# EAGLE design MinieasySens-RFM_V03-Build007 (EAGLE 9.3.0)
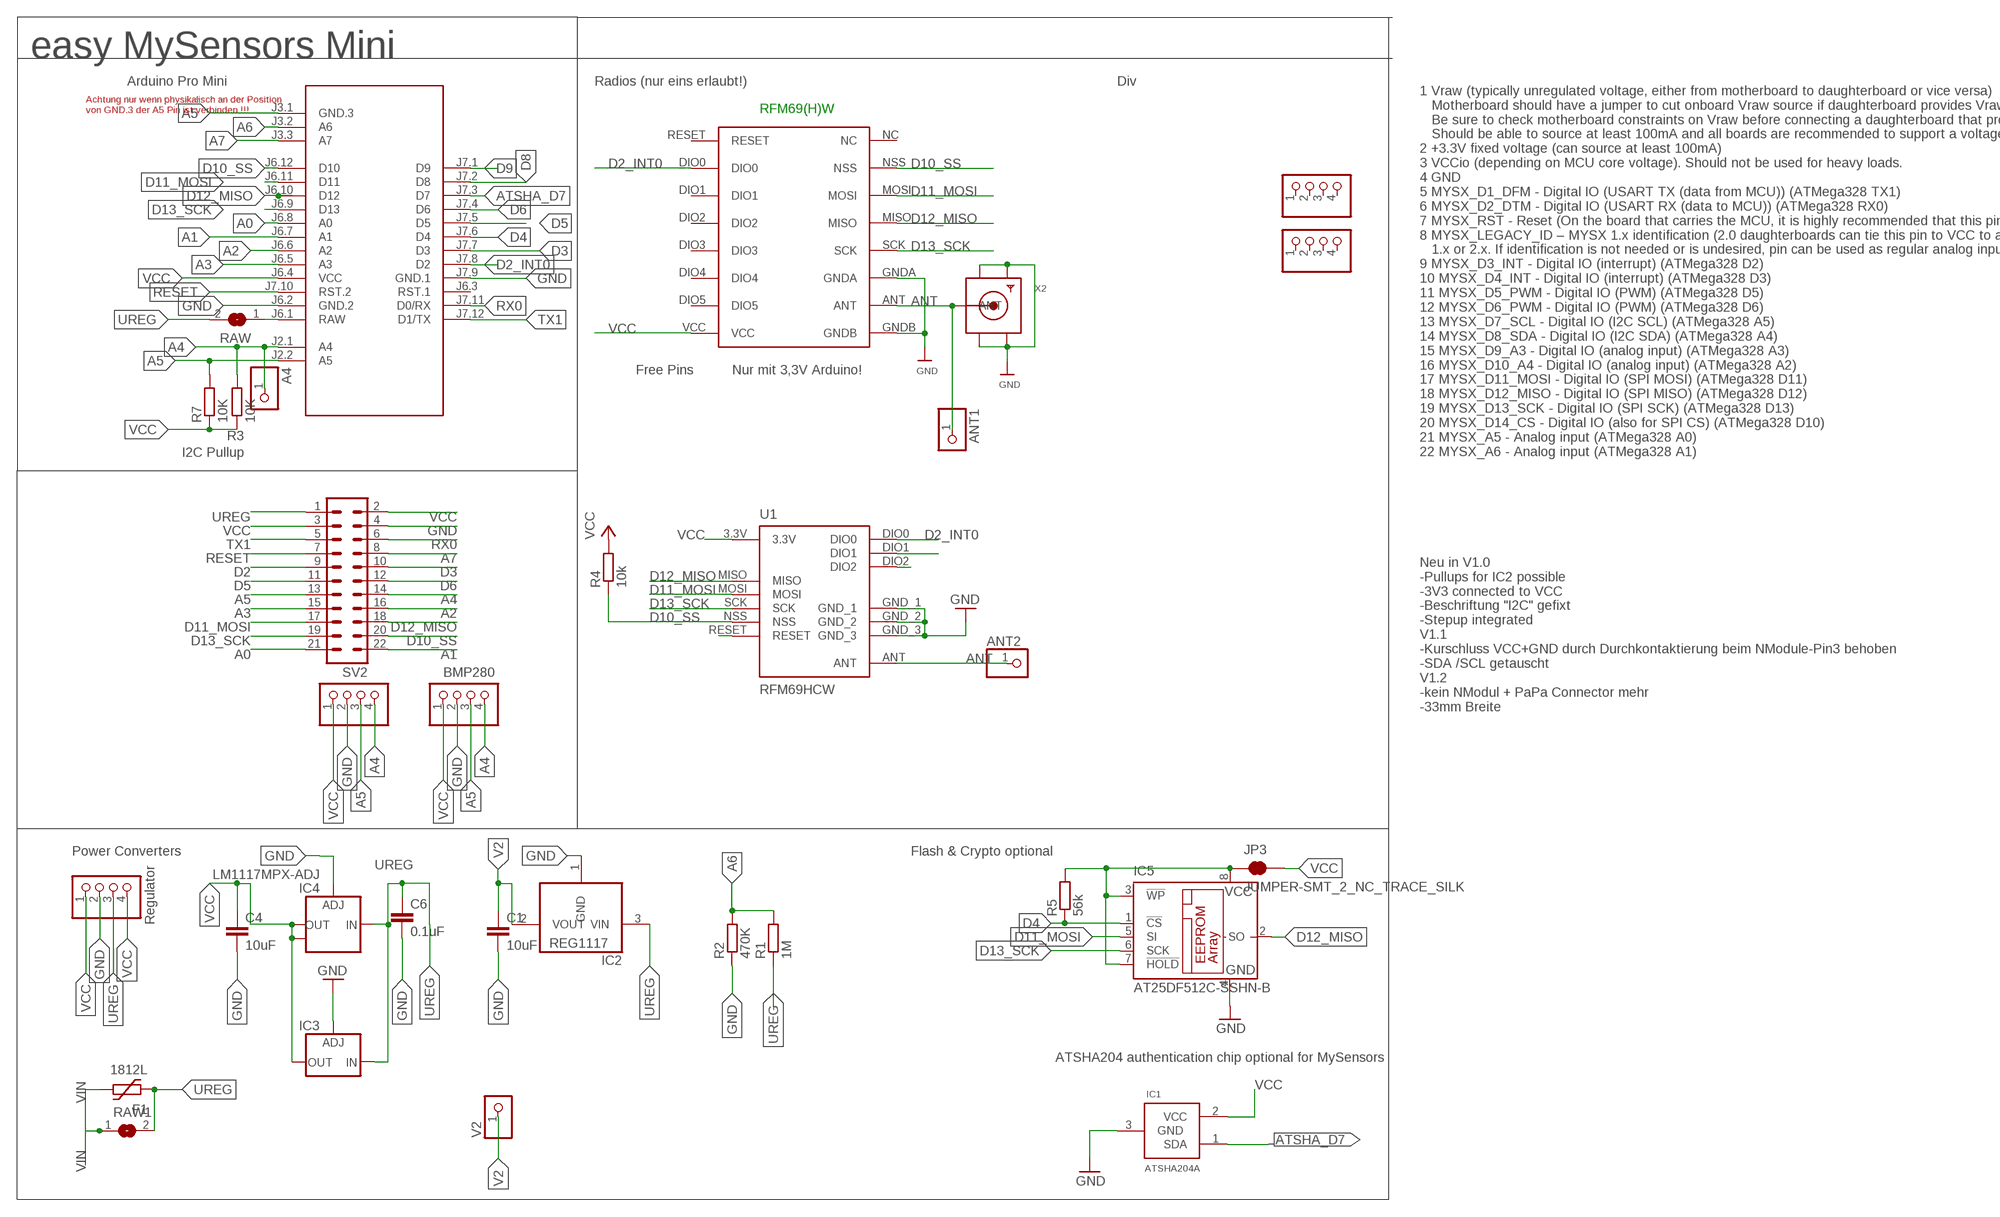
[diagram p0: schematic, sheet 1, part 1 of 2]
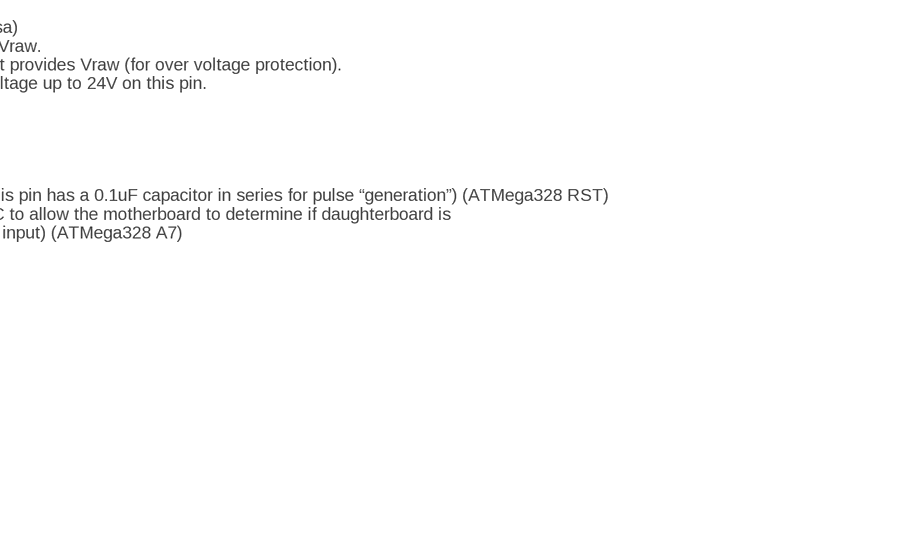
[diagram p1: schematic, sheet 1, part 2 of 2]

## Parts
A4  PINHD-1X1  [1X01]
ANT1  PINHD-1X1  [1X01]
ANT2  PINHD-1X1  [1X01]
BH1750  PINHD-1X04_2.54-S  [1X04-S]
C1  10uF  C-EUC1210  [C1210]
C4  10uF  C-EUC1210  [C1210]
C6  0.1uF  C-EUC1206  [C1206]
F1  1812L  [1812L]
I2C-1  PINHD-1X04_2.54-S  [1X04-S]
IC1  ATSHA204A  [SOT23]
IC2  REG1117  [SOT223]
IC3  LD117ADT50TR  [DPACK]
IC4  LM1117MPX-ADJ  [SOT223]
IC5  AT25DF512C-SSHN-B  25AA080SN  [SO-08]
JP1  PINHD-1X04_2.54-S  [1X04-S]
JP2  PINHD-1X04_2.54-S  [1X04-S]
JP3  JUMPER-SMT_2_NC_TRACE_SILK  [SMT-JUMPER_2_NC_TRACE_SILK]
M1  ARDUINO-PRO-MINI-3.3V#NP  [ARDUINO-PRO-MINI#NP]
R1  1M  R-EU_R0805  [R0805]
R2  470K  R-EU_R0805  [R0805]
R3  10K  R-EU_R0805  [R0805]
R4  10k  R-EU_M0805  [M0805]
R5  56k  R-EU_M0805  [M0805]
R7  10K  R-EU_R0805  [R0805]
RAW  SJ  [SJ]
RAW1  SJ  [SJ]
RFM69W  RFM69HW  [RFM]
STEPDWN  PINHD-1X04_2.54-S  [1X04-S]
SV2  MA11-2  [MA11-2]
U1  RFM69HCW  [RFM69HCW-XXXS2]
V2  PINHD-1X1  [1X01]
X2  SMACONNECTOR_EDGE  [SMA_EDGELAUNCH]

## Nets
A0: M1.J6.8(A0) SV2.21
A1: M1.J6.7(A1) SV2.22
A2: M1.J6.6(A2) SV2.16
A3: M1.J6.5(A3) SV2.15
A4: A4.1 BH1750.4 I2C-1.4 M1.J2.1(A4) R3.2 SV2.14
A5: BH1750.3 I2C-1.3 M1.J2.2(A5) M1.J3.1(GND.3) R7.2 SV2.13
A6: M1.J3.2(A6) R1.2 R2.2
A7: M1.J3.3(A7) SV2.8
ANT: ANT1.1 ANT2.1 RFM69W.ANT U1.ANT X2.P(ANT)
ATSHA_D7: IC1.1(SDA) M1.J7.3(D7)
D2: SV2.9
D2_INT0: M1.J7.8(D2) RFM69W.DIO0 U1.DIO0
D3: M1.J7.7(D3) SV2.10
D4: IC5.1(!CS) M1.J7.6(D4) R5.1
D5: M1.J7.5(D5) SV2.11
D6: M1.J7.4(D6) SV2.12
D8: M1.J7.2(D8)
D9: M1.J7.1(D9)
D10_SS: M1.J6.12(D10) R4.1 RFM69W.NSS SV2.20 U1.NSS
D11_MOSI: IC5.5(SI) M1.J6.11(D11) RFM69W.MOSI SV2.17 U1.MOSI
D12_MISO: IC5.2(SO) M1.J6.10(D12) RFM69W.MISO SV2.18 U1.MISO
D13_SCK: IC5.6(SCK) M1.J6.9(D13) RFM69W.SCK SV2.19 U1.SCK
GND [PWR]: BH1750.2 C1.2 C4.2 C6.2 I2C-1.2 IC1.3(GND) IC2.1(GND) IC3.1(ADJ) IC4.1(ADJ) IC5.4(GND) M1.J6.2(GND.2) M1.J7.9(GND.1) R2.1 RFM69W.GNDA RFM69W.GNDB STEPDWN.2 SV2.4 U1.GND_1 U1.GND_2 U1.GND_3 X2.GND@1(GND4) X2.GND@2(GND3) X2.GND@3(GND2) X2.GND@4(GND1)
N$3: U1.RESET
N$14: U1.DIO2
N$15: U1.DIO1
RAW [PWR]: M1.J6.1(RAW) RAW.1
RESET: M1.J7.10(RST.2) SV2.7
RX0: M1.J7.11(D0/RX) SV2.6
TX1: M1.J7.12(D1/TX) SV2.5
UREG [PWR]: C6.1 F1.P$1 IC2.3(VIN) IC3.3(IN) IC4.3(IN) R1.1 RAW1.2 RAW.2 STEPDWN.3 SV2.1
V2 [PWR]: C1.1 IC2.2(VOUT) V2.1
VCC [PWR]: BH1750.1 C4.1 I2C-1.1 IC1.2(VCC) IC3.4(OUT) IC4.2(OUT) IC4.TAB(OUT1) JP3.2 M1.J6.4(VCC) R3.1 R4.2 R7.1 RFM69W.VCC STEPDWN.1 STEPDWN.4 SV2.2 SV2.3 U1.3.3V
VCC1 [PWR]: IC5.3(!WP) IC5.7(!HOLD) IC5.8(VCC) JP3.1 R5.2
VIN [PWR]: F1.P$2 RAW1.1
Unconnected: JP1.1 JP1.2 JP1.3 JP1.4 JP2.1 JP2.2 JP2.3 JP2.4 M1.J6.3(RST.1) RFM69W.DIO1 RFM69W.DIO2 RFM69W.DIO3 RFM69W.DIO4 RFM69W.DIO5 RFM69W.NC RFM69W.RESET

## Notes on the sheet
- easy MySensors Mini
- Arduino Pro Mini | Radios (nur eins erlaubt!) | Div
- Achtung nur wenn physikalisch an der Position 
  von GND.3 der A5 Pin ist verbinden !!!
- RFM69(H)W
- Free Pins | Nur mit 3,3V Arduino!
- I2C Pullup
- 1 Vraw (typically unregulated voltage, either from motherboard to daughterboard or vice versa)
     Motherboard should have a jumper to cut onboard Vraw source if daughterboard provides Vraw. 
     Be sure to check motherboard constraints on Vraw before connecting a daughterboard that provides Vraw (for over voltage protection). 
     Should be able to source at least 100mA and all boards are recommended to support a voltage up to 24V on this pin.
  2 +3.3V fixed voltage (can source at least 100mA)
  3 VCCio (depending on MCU core voltage). Should not be used for heavy loads.
  4 GND
  5 MYSX_D1_DFM - Digital IO (USART TX (data from MCU)) (ATMega328 TX1)
  6 MYSX_D2_DTM - Digital IO (USART RX (data to MCU)) (ATMega328 RX0)
  7 MYSX_RST - Reset (On the board that carries the MCU, it is highly recommended that this pin has a 0.1uF capacitor in series for pulse “generation”) (ATMega328 RST)
  8 MYSX_LEGACY_ID – MYSX 1.x identification (2.0 daughterboards can tie this pin to VCC to allow the motherboard to determine if daughterboard is 
     1.x or 2.x. If identification is not needed or is undesired, pin can be used as regular analog input) (ATMega328 A7)
  9 MYSX_D3_INT - Digital IO (interrupt) (ATMega328 D2)
  10 MYSX_D4_INT - Digital IO (interrupt) (ATMega328 D3)
  11 MYSX_D5_PWM - Digital IO (PWM) (ATMega328 D5)
  12 MYSX_D6_PWM - Digital IO (PWM) (ATMega328 D6)
  13 MYSX_D7_SCL - Digital IO (I2C SCL) (ATMega328 A5)
  14 MYSX_D8_SDA - Digital IO (I2C SDA) (ATMega328 A4)
  15 MYSX_D9_A3 - Digital IO (analog input) (ATMega328 A3)
  16 MYSX_D10_A4 - Digital IO (analog input) (ATMega328 A2)
  17 MYSX_D11_MOSI - Digital IO (SPI MOSI) (ATMega328 D11)
  18 MYSX_D12_MISO - Digital IO (SPI MISO) (ATMega328 D12)
  19 MYSX_D13_SCK - Digital IO (SPI SCK) (ATMega328 D13)
  20 MYSX_D14_CS - Digital IO (also for SPI CS) (ATMega328 D10)
  21 MYSX_A5 - Analog input (ATMega328 A0)
  22 MYSX_A6 - Analog input (ATMega328 A1)
- BMP280
- Neu in V1.0
  -Pullups for IC2 possible
  -3V3 connected to VCC
  -Beschriftung "I2C" gefixt
  -Stepup integrated
  V1.1
  -Kurschluss VCC+GND durch Durchkontaktierung beim NModule-Pin3 behoben
  -SDA /SCL getauscht
  V1.2
  -kein NModul + PaPa Connector mehr
  -33mm Breite
- Power Converters | Flash & Crypto optional
- Regulator
- ATSHA204 authentication chip optional for MySensors

## Library data of the parts
A4 ANT1 ANT2 V2 = pinhead:PINHD-1X1: PIN HEADER
BH1750 I2C-1 JP1 JP2 STEPDWN = pinhead-2:PINHD-1X04: PIN HEADER
C1 C4 C6 = rcl:C-EU: CAPACITOR, European symbol
F1 = ptc-littlefuse:1812L
IC1 = Sensor:ATSHA204A
IC2 = burr-brown:REG1117: 800mA and 1A Low Dropout (LDO) Positive Regulator 1.8V, 2.5V, 2.85V, 3.3V, 5V, and Adj; MPN: REG1117; OC_FARNELL: 1097566; OC_NEWARK: 14P6981
IC3 = v-reg:LD117A?*: Low drop fixed and adjustable positive voltage regulators 1 A Source: http://www.st.com/stonline/products/literature/ds/7194/ld1117axx.pdf
IC4 = lm1117:LM1117MPX-ADJ
IC5 = microchip:25*: Serial EEPROM 4K/ 8K , SPI bus; MF: MICROCHIP; MPN: 25AA080/SN; OC_FARNELL: 1816072; OC_NEWARK: 92C7351
JP3 = SparkFun-Jumpers:JUMPER-SMT_2_NC_TRACE: Normally closed trace jumper This jumper has a trace between two pads so it's normally closed (NC). Use a razor knife to open the connection. For best results follow the IPC guidelines for cutting traces: Cutout at least 0.063 mm (0.005 in). Remove all loose material to clean up the cut area. Seal the cut with an approved epoxy. Reapply solder to reclose the connection.
M1 = diy-modules:ARDUINO-PRO-MINI-*#NP: Arduino Pro Mini without programming pads
R1-R4 R7 = rcl:R-EU_: RESISTOR, European symbol
R5 = resistor:R-EU_: RESISTOR, European symbol
RAW RAW1 = jumper:SJ: SMD solder JUMPER
RFM69W = hoperf:RFM69HW
SV2 = con-Pinheader:MA11-2: PIN HEADER; OC_FARNELL: unknown; OC_NEWARK: unknown
U1 = doug:RFM69H
X2 = adafruit:SMACONNECTOR: SMA Connector 90° DIP SMA Connector, 50 Ohm (4UConnector: 07259)

## Net classes
0 default: width 0.254 mm, clearance 0.205 mm
1 PWR: width 0.406 mm, clearance 0.205 mm to class 0, clearance 0.205 mm

## Board
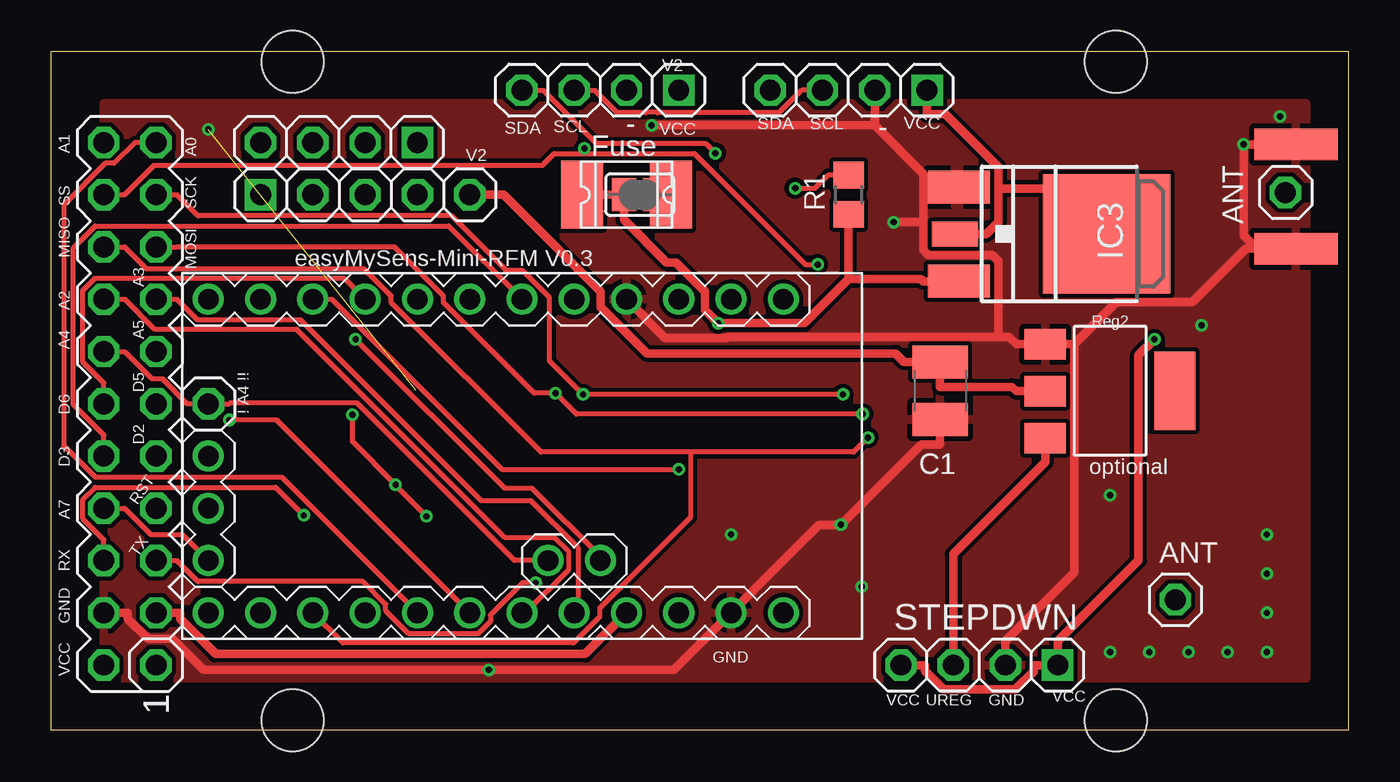
[diagram p2: board, top side]
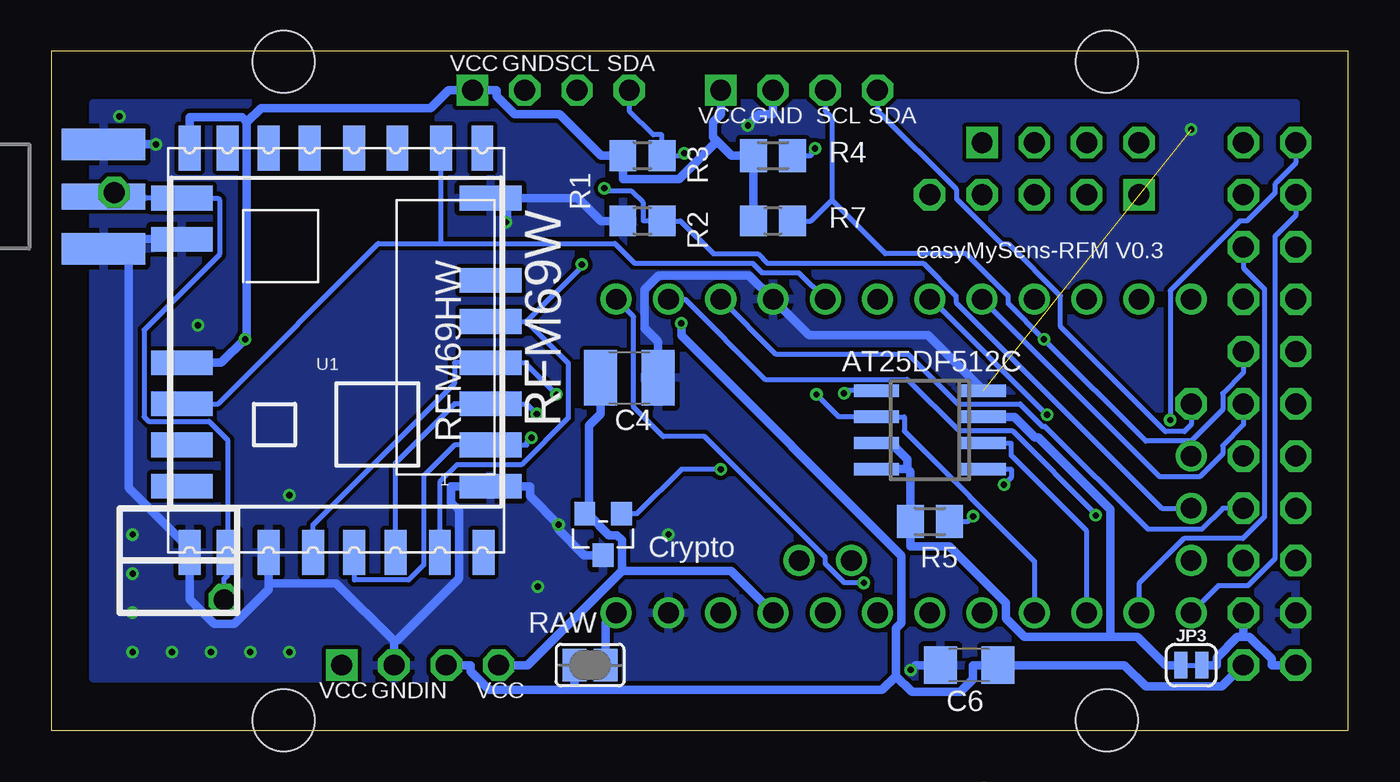
[diagram p3: board, bottom side, seen from below]

Size 63 x 33 mm. Coordinates in mm from the lower left corner, seen from the top.
Outline: 63,0 0,0 0,33 63,33 63,0
Copper layers (1*16): Top 0.035mm / dielectric 1.5mm / Bottom 0.035mm
Design rules "dirt_cheap_dirty_boards.v1": minimum track width 5mil, minimum drill 12mil, track to track 5mil, track to pad 5mil, pad to pad 5mil, via to via 5mil, smd to smd 0mil, copper to edge 10mil, drill to drill 10mil, minimum pad ring 10mil, minimum via ring 6mil, stop-mask expansion 2mil, vias tented up to drill 25mil, thermal gap 10mil
Holes 3 mm at 11.72,32.5 11.72,0.5 51.72,32.5 51.72,0.5
tRestrict: area 3.8,32.4 to 62.9,33; area 4.4,0 to 62.9,1.3
bRestrict: area 3.8,32.4 to 62.9,33; area 4.4,0 to 62.9,1.3

### Footprints (pad centres in the part's own frame; a part is rotated, then mirrored left to right if it is on the bottom)
1X01 = drill 1.016 octagon: 1 0,0
1X04-S = drill 1.016 square: 1 -3.81,0 | drill 1.016 octagon: 2 -1.27,0; 3 1.27,0; 4 3.81,0
C1210 = smd 1.6 x 2.7: 1 -1.4,0; 2 1.4,0
C1206 = smd 1.6 x 1.8: 1 -1.4,0; 2 1.4,0
1812L = smd 2.03 x 3.3: P$1 -2.16,0; P$2 2.16,0
SOT23 = smd 1.016 x 1.143: 1 -0.889,-1.016; 2 0.889,-1.016; 3 0,1.016
SOT223 = smd 1.499 x 2.007: 1 -2.261,-3.15; 2 0.025,-3.15; 3 2.311,-3.15 | smd 3.81 x 2.007: 4 0,3.15
DPACK = smd 1.6 x 3: 1 -2.28,-4.8; 3 2.28,-4.8 | smd 5.8 x 6.2: 4 0,2.38
SOT223' = smd 1.219 x 2.235: 1 -2.311,-3.099; 2 0,-3.099; 3 2.311,-3.099 | smd 3.6 x 2.2: TAB 0,3.099
SO-08 = smd 0.6 x 2.2: 1 -1.905,-2.6; 2 -0.635,-2.6; 3 0.635,-2.6; 4 1.905,-2.6; 5 1.905,2.6; 6 0.635,2.6; 7 -0.635,2.6; 8 -1.905,2.6
SMT-JUMPER_2_NC_TRACE_SILK = smd 0.635 x 1.27: 1 -0.508,0; 2 0.508,0
ARDUINO-PRO-MINI#NP = drill 1: J2.1 -1.27,5.08; J2.2 -3.81,5.08; J3.1 15.24,0; J3.2 15.24,2.54; J3.3 15.24,5.08; J6.1 -12.7,7.62; J6.2 -10.16,7.62; J6.3 -7.62,7.62; J6.4 -5.08,7.62; J6.5 -2.54,7.62; J6.6 0,7.62; J6.7 2.54,7.62; J6.8 5.08,7.62; J6.9 7.62,7.62; J6.10 10.16,7.62; J6.11 12.7,7.62; J6.12 15.24,7.62; J7.1 15.24,-7.62; J7.2 12.7,-7.62; J7.3 10.16,-7.62; J7.4 7.62,-7.62; J7.5 5.08,-7.62; J7.6 2.54,-7.62; J7.7 0,-7.62; J7.8 -2.54,-7.62; J7.9 -5.08,-7.62; J7.10 -7.62,-7.62; J7.11 -10.16,-7.62; J7.12 -12.7,-7.62
R0805 = smd 1.3 x 1.5: 1 -0.95,0; 2 0.95,0
M0805 = smd 1.3 x 1.6: 1 -0.95,0; 2 0.95,0
SJ = smd 1.168 x 1.6: 1 -0.762,0; 2 0.762,0
RFM = smd 2.184 x 1.067: ANT 19.651,2.889; DIO0 0,13.27; DIO1 0,11.143; DIO2 0,9.047; DIO3 0,6.889; DIO4 0,4.889; DIO5 0,2.889; GNDA 19.651,4.889; GNDB 19.651,1.048; MISO 19.651,9.047; MOSI 19.651,11.047; NC 19.651,15.334; NSS 19.651,13.206; RESET 0,15.27; SCK 19.651,7.048; VCC 0,1.048
MA11-2 = drill 1.016 octagon: 1 -12.7,-1.27; 2 -12.7,1.27; 3 -10.16,-1.27; 4 -10.16,1.27; 5 -7.62,-1.27; 6 -7.62,1.27; 7 -5.08,-1.27; 8 -5.08,1.27; 9 -2.54,-1.27; 10 -2.54,1.27; 11 0,-1.27; 12 0,1.27; 13 2.54,-1.27; 14 2.54,1.27; 15 5.08,-1.27; 16 5.08,1.27; 17 7.62,-1.27; 18 7.62,1.27; 19 10.16,-1.27; 20 10.16,1.27; 21 12.7,-1.27; 22 12.7,1.27
RFM69HCW-XXXS2 = smd 3 x 1.2: 3.3V 7.5,1; ANT 7.5,-7; DIO0 7.5,3; DIO1 7.5,5; DIO2 7.5,7; GND_1 7.5,-5; GND_2 -7.5,-7; GND_3 -7.5,7; MISO -7.5,5; MOSI -7.5,3; NSS -7.5,-1; RESET -7.5,-3; SCK -7.5,1
SMA_EDGELAUNCH = smd 4.064 x 1.524: GND@1 2.032,-2.54; GND@2 2.032,2.54 | smd 4.064 x 1.524 bottom: GND@3 2.032,2.54; GND@4 2.032,-2.54 | smd 4.064 x 1.27: P 2.032,0

### Placement (x,y rotation side)
A4  7.62,15.88 90 top
ANT1  59.96,26.14 0 top
ANT2  54.61,6.35 0 top
BH1750  38.73,31.11 180 top
C1  43.18,16.51 270 top
C4  34.92,17.14 0 bottom
C6  18.41,3.17 180 bottom
F1  27.94,26.04 0 top
I2C-1  26.67,31.11 180 top
IC1  36.2,9.53 180 bottom
IC2  51.44,16.51 270 top
IC3  48.9,24.13 270 top
IC4  LM1117MPX-ADJ  [SOT223']  46.99,24.13 270 top
IC5  20.32,14.61 90 bottom
JP1  13.97,26.04 0 top
JP2  13.97,28.57 180 top
JP3  7.62,3.17 0 bottom
M1  22.86,13.34 180 top
R1  38.73,26.04 90 top
R2  34.29,24.77 0 bottom
R3  34.29,27.94 0 bottom
R4  27.94,27.94 180 bottom
R5  20.32,10.16 180 bottom
R7  27.94,24.77 0 bottom
RAW  36.83,3.17 180 bottom
RAW1  28.57,26.04 180 top
RFM69W  57.34,28.3 270 bottom
STEPDWN  45.09,3.17 180 top
SV2  3.81,15.88 90 top
U1  49.16,18.87 180 bottom
V2  20.32,26.04 0 top
X2  62.5,25.95 0 bottom

### Tracks (layer width: path | path; a pad name or v marks a point on that pad's centre or on a via)
A0
  Top 0.254: SV2.21 4.06,28.57 3.05,27.56 2.62,27.56 0.6,25.54 0.6,13.84 2.12,12.32 11.18,12.32 M1.J6.8
A1  (via drill 0.3 pad 0.61)
  Top 0.254: M1.J6.7 10.95,15.09 v8.64,15.09
  Bottom 0.254: v8.64,15.09 8.64,21.38 5.25,24.77 4.91,24.77 3.56,26.12 3.56,26.54 2.54,27.56 SV2.22
A2
  Top 0.254: M1.J6.6 23.02,5.71 25.14,7.84 25.14,8.67 24.45,9.36 22.05,9.36 11.92,19.49 5.02,19.49 3.56,20.95 SV2.16
A3
  Top 0.254: M1.J6.5 25.6,5.92 25.6,8.87 23.31,11.16 20.89,11.16 12.11,19.95 7.1,19.95 6.1,20.95 SV2.15
A4  (via drill 0.3 pad 0.61)
  Top 0.254: M1.J2.1 22.5,8.26 14.86,15.9 8.66,15.9 8.64,15.88 A4.1 6.6,15.88 5.38,17.1 4.87,17.1 3.56,18.41 SV2.14 | v32.26,28.05 31.8,28.51 26.48,28.51 23.88,31.11 I2C-1.4
  Bottom 0.254: I2C-1.4 22.86,30.1 22.83,30.1 19.01,26.27 19.01,25.82 16.81,23.63 16.48,23.63 13.97,21.11 13.97,19.63 8.87,14.53 7.95,14.53 7.62,14.86 A4.1 | v32.26,28.05 32.32,28.05 32.44,27.94 R3.2 33.34,28.94 33.77,28.94 34.92,30.1 BH1750.4
A5  (via drill 0.3 pad 0.61)
  Top 0.254: v14.78,19.01 22.01,11.78 23.34,11.78 26.67,8.45 M1.J2.2 | BH1750.3 36.45,31.11 35.35,30.02 29.45,30.02 29.42,30.05 28.89,30.05 28.87,30.02 27.49,30.02 26.42,31.09 26.42,31.11 I2C-1.3
  Bottom 0.254: 7.62,14.07 M1.J3.1 | 7.62,14.07 6.1,15.59 6.1,16.38 5.08,17.4 SV2.13 | 7.62,14.07 9.84,14.07 v14.78,19.01 16.51,20.74 16.51,21.12 18.56,23.17 22.48,23.17 25.08,25.77 | 25.08,25.77 26.09,24.77 R7.2 | 25.08,25.77 25.08,29.78 25.4,30.1 I2C-1.3
A6  (via drill 0.3 pad 0.61)
  Top 0.254: R1.2 37.73,26.98 37.1,26.35 v36.13,26.35
  Bottom 0.254: M1.J3.2 9.05,10.79 19.05,20.8 19.05,21.11 20.64,22.71 28.22,22.71 28.68,23.17 30.84,23.17 32.44,24.77 R2.2 33.79,24.77 34.24,24.77 34.24,25.64 34.81,26.2 35.98,26.2 v36.13,26.35
A7
  Top 0.254: SV2.8 3.56,10.79 4.83,9.53 6.35,9.53 M1.J3.3
ANT
  Bottom 0.254: ANT2.1 54.61,7.37 54.45,7.53 RFM69W.ANT 54.45,14.12 55.34,15.02 58.27,15.02 58.5,15.24 58.5,19.47 54.83,23.13 54.83,25.79 54.91,25.87 U1.ANT 58.42,25.87 58.6,26.05 59.96,26.05 | X2.P 60.06,25.95 59.96,26.05 | 59.96,26.05 ANT1.1
ATSHA_D7  (via drill 0.3 pad 0.61)
  Top 0.254: M1.J7.3 13.62,20.95 21.89,12.69 v30.48,12.69
  Bottom 0.254: IC1.1 34.54,10.54 32.4,12.69 v30.48,12.69
D2_INT0
  Bottom 0.254: 44.06,23.66 35.62,23.66 34.66,22.71 28.94,22.71 28.48,22.25 26.69,22.25 M1.J7.8 | 44.06,23.66 RFM69W.DIO0 | 44.06,23.66 47.12,23.66 54.91,15.87 U1.DIO0
D3
  Top 0.254: M1.J7.7 19.3,24.51 2.12,24.51 1.06,23.45 1.06,15.83 2.54,14.35 SV2.10
D4  (via drill 0.3 pad 0.61)
  Top 0.254: v14.62,15.34 14.62,14.04 v16.72,11.94 16.72,11.9 v18.22,10.41
  Bottom 0.254: v14.62,15.34 20.24,20.95 M1.J7.6 | v18.22,10.41 18.47,10.16 R5.1 | v16.72,11.94 16.37,12.29 16.37,12.7 IC5.1
D5
  Bottom 0.254: M1.J7.5 9.15,12.32 7.2,12.32 6.1,13.43 6.1,13.84 5.08,14.86 SV2.11
D6
  Top 0.254: M1.J7.4 14.22,21.98 2.12,21.98 1.52,21.38 1.52,17.91 2.54,16.89 SV2.12
D10_SS  (via drill 0.3 pad 0.61)
  Top 0.254: 25.9,28.04 31.24,28.04 36.64,22.64 v37.23,22.64 | 25.9,28.04 v25.9,28.29 | 25.9,28.04 24.43,28.04 23.86,27.47 4.99,27.47 3.56,26.04 SV2.20
  Bottom 0.254: SV2.20 2.54,25.02 3.56,24 3.56,8.34 4.87,7.03 6.31,7.03 M1.J6.12 | v37.23,22.64 37.23,22.55 39.91,19.87 | 39.91,19.87 37.9,17.86 37.9,15.17 40.16,12.91 43.3,12.91 44.13,12.07 RFM69W.NSS | U1.NSS 39.91,19.87 | v25.9,28.29 26.09,28.1 26.09,27.94 R4.1
D11_MOSI  (via drill 0.3 pad 0.61)
  Top 0.254: v39.42,15.38 25.5,15.38 v24.49,16.39 23.45,16.39 19.05,20.79 19.05,21.11 16.67,23.5 6.1,23.5 SV2.17
  Bottom 0.254: v24.49,16.39 24.37,16.51 24.27,16.51 IC5.5 | SV2.17 5.08,22.48 4.06,21.46 4.06,10.38 5.11,9.33 7.98,9.33 10.16,7.14 M1.J6.11 | v39.42,15.38 39.91,15.87 U1.MOSI 43.42,15.87 46.29,13 RFM69W.MOSI
D12_MISO  (via drill 0.3 pad 0.61)
  Top 0.254: 31.04,13.53 23.78,13.53 16.51,20.8 16.51,21.12 15.19,22.43 4.62,22.43 3.56,23.5 SV2.18 | v39.68,14.23 38.98,13.53 31.04,13.53 | 31.04,13.53 31.04,10.36 26.63,5.94 26.63,5.52 25.36,4.25 14.17,4.25 M1.J6.10
  Bottom 0.254: IC5.2 16.37,13.97 16.37,13.35 12.7,9.69 M1.J6.10 | v39.68,14.23 39.91,13.99 39.91,13.87 U1.MISO 42.16,13.87 43.42,13.87 44.92,12.37 44.92,8.04 45.65,7.31 48.29,7.31 RFM69W.MISO
D13_SCK  (via drill 0.3 pad 0.61)
  Top 0.254: v38.46,16.33 v25.83,16.33 24.2,17.96 24.2,21.05 22.9,22.34 22.12,22.34 19.45,25.02 7.11,25.02 6.1,26.04 SV2.19
  Bottom 0.254: M1.J6.9 15.24,8.22 21.57,14.54 21.57,15.24 IC5.6 23.54,15.24 24.27,15.24 24.74,15.24 v25.83,16.33 | RFM69W.SCK 50.29,10 43.42,16.87 43.42,17.87 U1.SCK 40.79,17.87 39.91,17.87 39.91,17.78 v38.46,16.33
GND  (via drill 0.3 pad 0.61)  (1 unrouted)
  Top 0.406: 42.37,24.7 42.37,26.44 | 46.01,19.12 46.01,22.82 45.71,23.11 42.59,23.11 42.37,23.34 42.37,24.7 | 42.37,24.7 v40.92,24.7 | 40,29.41 40.01,29.41 40.01,29.95 BH1750.2 | v29.16,29.41 40,29.41 | 42.37,26.44 42.37,27.04 40,29.41 | 46.01,19.12 32.87,19.12 32.83,19.08 29.82,19.08 M1.J7.9 | 46.01,19.12 46.53,19.12 46.87,18.77 IC2.1 49.7,18.77 | 42.37,26.44 IC4.1 44.06,26.44 IC3.1 | 58.56,23.41 57.92,24.05 v57.92,28.48 58.42,28.48 58.43,28.49 X2.GND@2 | 58.56,23.41 58.03,23.41 55.44,20.82 51.75,20.82 49.7,18.77 | X2.GND@1 58.56,23.41 | SV2.4 3.71,5.71 3.71,5.43 4.69,4.45 5.9,4.45 7.4,2.94 v21.25,2.94 30.25,2.94 M1.J6.2 37.3,10 v38.36,10 42.27,13.9 43.18,13.9 C1.2 | STEPDWN.2 46.35,4.34 49.7,7.69 49.7,18.77
  Bottom 0.406: 40.86,25.87 40.86,24.76 v40.92,24.7 | 40.86,25.87 39.76,25.87 37.4,25.87 36.3,24.77 35.77,24.77 35.74,24.77 R2.1 | U1.GND_2 40.86,25.87 | 59.25,23.41 59.03,23.41 58.57,23.87 U1.GND_1 | 59.25,23.41 59.25,11.78 56.66,9.19 56.29,9.19 RFM69W.GNDB 56.29,6.37 55.09,5.18 54.13,5.18 52.45,6.86 52.45,7.15 | 46.35,4.34 49.16,7.15 52.45,7.15 | X2.GND@1 59.25,23.41 | v57.92,28.48 57.94,28.49 58.03,28.49 X2.GND@2 | I2C-1.2 27.94,29.95 28.62,29.95 v29.16,29.41 | IC5.4 20.43,19.21 26.2,19.21 M1.J7.9 29.1,22.12 33.5,22.12 34.18,21.44 34.18,19.56 33.52,18.9 C4.2 | v21.25,2.94 21.02,3.17 C6.2 | 46.35,4.34 46.23,4.34 43.19,7.39 43.19,10.71 43.57,11.09 43.57,11.87 U1.GND_3 39.76,11.87 39.76,11.39 v38.36,10 38.36,9.76 37.11,8.51 IC1.3 | 46.35,4.34 46.35,4.19 STEPDWN.2 | RFM69W.GNDA 52.45,7.15
  other vias: 7.62,29.21 51.44,3.81 53.34,3.81 55.24,3.81 57.15,3.81 59.05,3.81 59.05,5.71 59.05,7.62 59.05,9.53 59.69,29.84 55.88,19.68 51.44,11.43 39.37,6.99 33.02,9.53
  pour Top: 2.54,30.48 2.54,2.54 60.96,2.54 60.96,30.48
  pour Bottom: 2.54,30.48 60.96,30.48 60.96,2.54 2.54,2.54
RAW
  Bottom 0.406: RAW.1 36.07,5.21 M1.J6.1
RESET
  Bottom 0.254: M1.J7.10 27.83,18.3 21.39,18.3 18.96,15.87 15.94,15.87 14.86,14.78 14.72,14.78 9.72,9.79 7.1,9.79 6.1,10.79 SV2.7
RX0  (via drill 0.3 pad 0.61)
  Top 0.254: SV2.6 2.54,9.27 1.52,10.29 1.52,11.21 2.13,11.82 10.89,11.82 v12.26,10.45
  Bottom 0.254: M1.J7.11 32.21,20.95 28.32,17.07 21.42,17.07 18.92,14.57 16.31,14.57 12.26,10.51 v12.26,10.45
TX1  (via drill 0.3 pad 0.61)
  Top 0.254: v23.53,7.17 22.89,7.17 21.33,5.61 21.33,5.29 20.74,4.71 17.36,4.71 16.25,5.82 16.25,6.13 15.14,7.24 7.11,7.24 6.1,8.26 SV2.5
  Bottom 0.254: v23.53,7.17 24.48,7.17 25.4,8.1 25.4,8.42 31.26,14.28 33.28,14.28 34.72,15.71 34.72,20.11 M1.J7.12
UREG  (via drill 0.3 pad 0.61)
  Top 0.406: 38.73,21.93 42.25,21.93 42.37,21.82 IC4.3 44.06,21.82 IC3.3 | 38.73,21.93 36.59,19.79 v32.39,19.79 31.75,20.44 31.75,21.34 30.34,22.75 29.89,22.75 27.81,24.83 RAW1.2 27.2,26.04 F1.P$1 | 38.73,21.93 R1.1 | IC2.3 48.28,13.04 43.81,8.57 43.81,4.34 STEPDWN.3
  Bottom 0.406: STEPDWN.3 42.65,3.17 42.65,2.88 41.73,1.97 37.59,1.97 | 21.97,2.64 21.97,4.96 21.69,5.24 21.69,8.49 32.39,19.19 v32.39,19.79 | 21.97,2.64 21.19,1.87 18.84,1.87 18.22,2.49 18.22,3.17 C6.1 10.87,3.17 9.82,2.13 6.12,2.13 SV2.1 | 21.97,2.64 22.64,1.97 37.59,1.97 | RAW.2 37.59,1.97
V2
  Top 0.406: V2.1 21.97,26.04 26.67,21.33 26.67,20.58 28.93,18.32 41.01,18.32 41.42,17.91 C1.1 43.18,16.7 46.66,16.7 46.87,16.48 IC2.2
VCC  (via drill 0.3 pad 0.61)
  Top 0.406: v53.59,19.01 52.82,18.24 52.82,8.27 48.9,4.34 STEPDWN.1 47.73,3.17 47.73,2.88 46.85,2 43.33,2 42.45,2.89 42.45,3.17 STEPDWN.4 | 46,26.34 46,24.72 45.42,24.13 IC4.2 | 46,26.34 46,27.38 43.44,29.95 42.55,29.95 BH1750.1 | 46,26.34 50.09,26.34 IC4.TAB IC3.4 | SV2.3 6.25,5.71 6.25,5.43 7.97,3.71 25.94,3.71 M1.J6.4
  Bottom 0.406: 53.5,29.57 52.82,30.25 44.58,30.25 43.72,31.11 BH1750.1 41.38,31.11 41.38,30.82 40.5,29.95 38.3,29.95 36.3,27.94 R3.1 35.24,26.78 32.52,26.78 30.65,28.64 | 53.5,29.57 53.74,29.8 56.29,29.8 RFM69W.VCC | 53.5,29.57 53.5,19.09 v53.59,19.01 53.62,19.01 54.76,17.87 U1.3.3V | 35.28,7.76 35.28,9.25 35.52,9.49 35.91,9.49 36.89,10.47 36.89,10.54 | STEPDWN.4 39.87,3.17 35.28,7.76 | M1.J6.4 29.99,7.76 35.28,7.76 | 36.89,10.54 IC1.2 | 36.89,10.54 36.89,14.82 36.33,15.39 C4.1 | 30.65,28.64 30.85,28.84 30.85,29.57 30.48,29.95 I2C-1.1 | 30.65,28.64 29.95,27.94 29.42,27.94 R4.2 R7.1 | SV2.2 3.71,3.17 3.71,3.47 4.79,4.54 5.08,4.54 | JP3.2 6.39,3.17 6.39,3.53 5.37,4.54 5.08,4.54 | SV2.3 5.08,4.54
VCC1
  Bottom 0.406: 11.54,4.55 10.23,4.55 8.85,3.17 JP3.1 | 11.54,4.55 15.73,4.55 16.62,5.44 16.62,6.2 19.37,8.95 21.27,8.95 R5.2 21.27,10.76 21.27,11.37 21.27,12.56 21.41,12.7 | 11.54,4.55 11.54,10.75 15.04,14.25 15.22,14.25 16.21,15.24 IC5.3 | IC5.8 21.41,12.7 | 21.41,12.7 21.41,13.18 22.21,13.97 IC5.7
VIN
  Top 0.406: RAW1.1 F1.P$2

### Text on the board
tPlace: A0 | A1 | SCK | SS | R1 | ANT | MOSI | MISO | A3 | easyMySens-Mini-RFM V0.3 | A2 | A5 | Reg2 | A4 | D5 | ! A4 !! | D6 | D2 | D3 | C1 | optional | RST | A7 | RX | TX | ANT | GND | VCC | GND | VCC | UREG | GND | VCC
bPlace: easyMySens-RFM V0.3
tNames: V2 | SCL | - | VCC | - | VCC | SDA | Fuse | SDA | SCL | V2
bNames: SDA | SCL | GND | VCC | SDA | SCL | GND | VCC | R4 | R3 | R1 | R2 | R7 | AT25DF512C | C4 | R5 | Crypto | RAW | VCC | IN | GND | VCC | C6 | C1
tValues: Gehäuse: RND 455‑00307